# EAGLE design garden-bot (EAGLE 8.3.2)
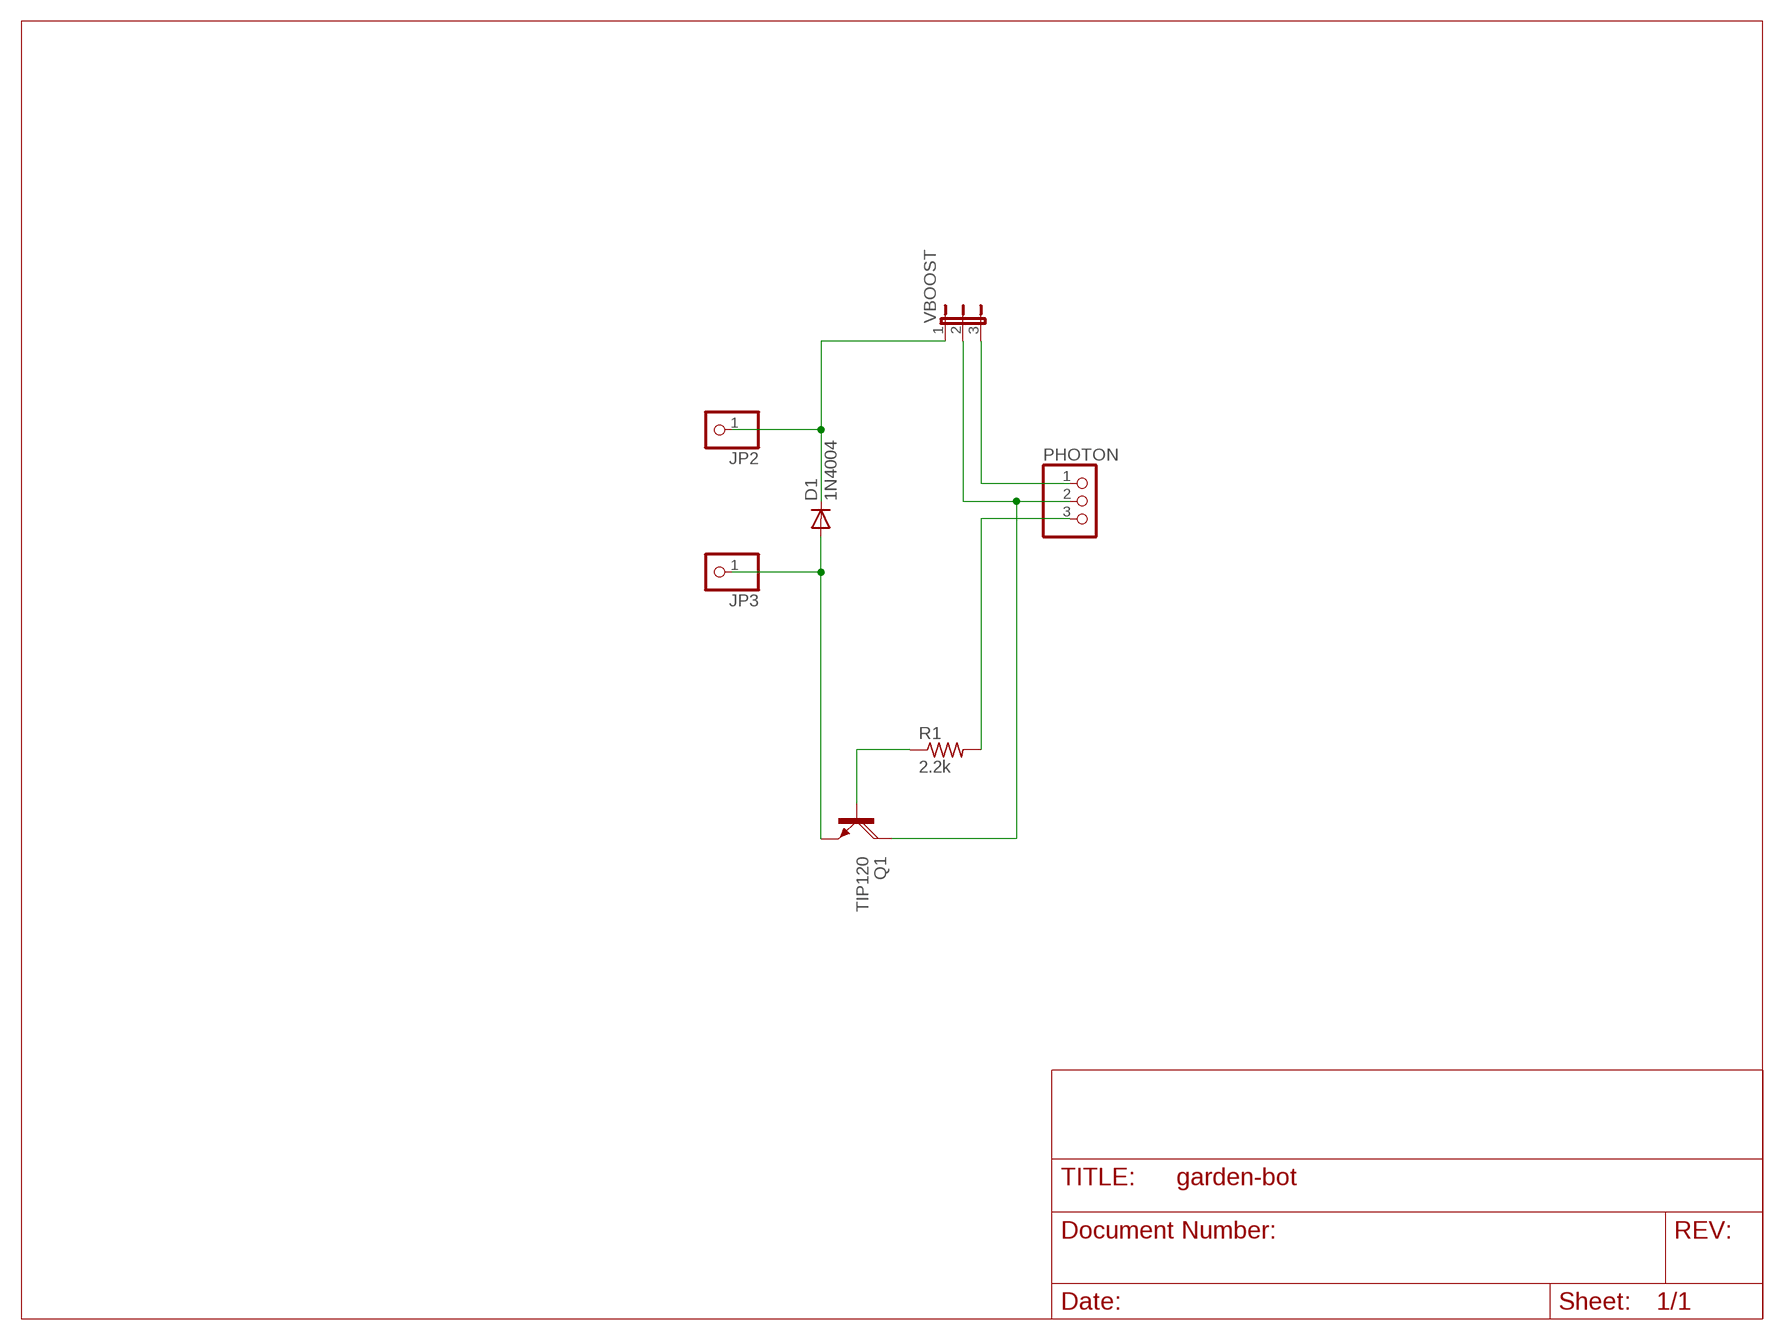
[diagram p0: schematic, sheet 1]

## Parts
D1  1N4004  [DO41-10]
JP2  PINHD-1X1  [1X01]
JP3  PINHD-1X1  [1X01]
PHOTON  PINHD-1X3  [1X03]
Q1  TIP120  [TO220AH]
R1  2.2k  R-US_0207/10  [0207/10]
VBOOST  JP2E  [JP2]

## Nets
D0: PHOTON.3 R1.2
GND: PHOTON.2 Q1.C VBOOST.2
N$2: Q1.B R1.1
N$5: D1.A JP3.1 Q1.E
VCC: PHOTON.1 VBOOST.3
VOUT: D1.C JP2.1 VBOOST.1

## Library data of the parts
D1 = adafruit:1N4004: DIODE General purpose 1N400x type rectifier (With bigger pads) http://www.ladyada.net/library/pcb/eaglelibrary.html
JP2 JP3 = adafruit:PINHD-1X1: Pin header 1x1 for 0.1" spacing With round pins
PHOTON = adafruit:PINHD-1X3: PIN HEADER
Q1 = transistor-power:TIP120: NPN DARLINGTON TRANSISTOR
R1 = adafruit:R-US_: RESISTOR, American symbol
VBOOST = jumper:JP2E: JUMPER

## Board
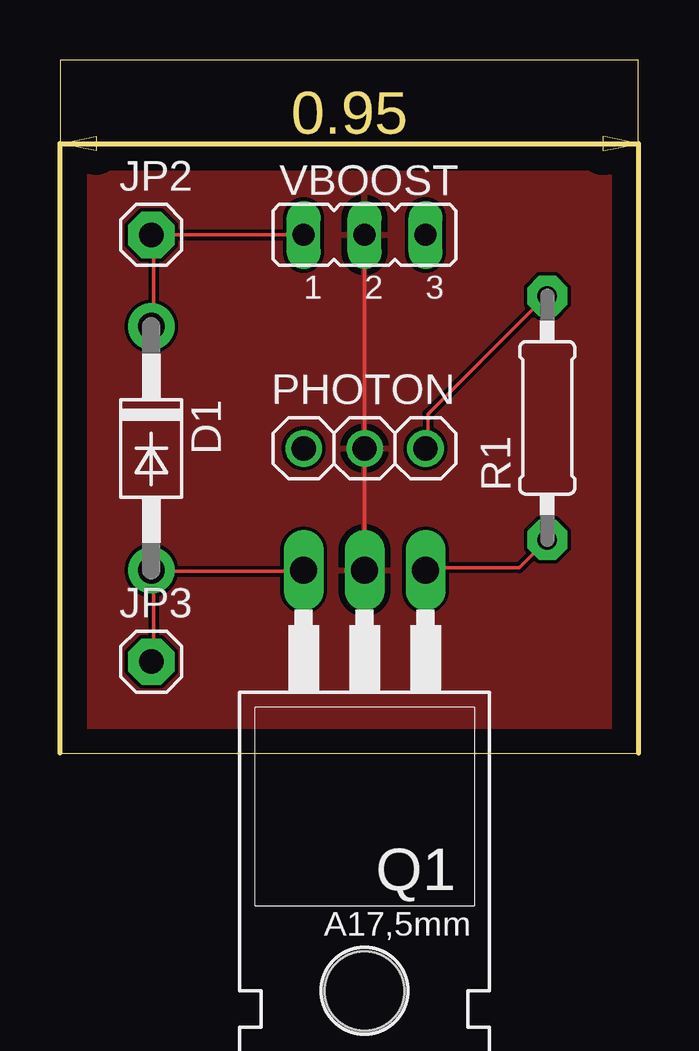
[diagram p1: board, top side]
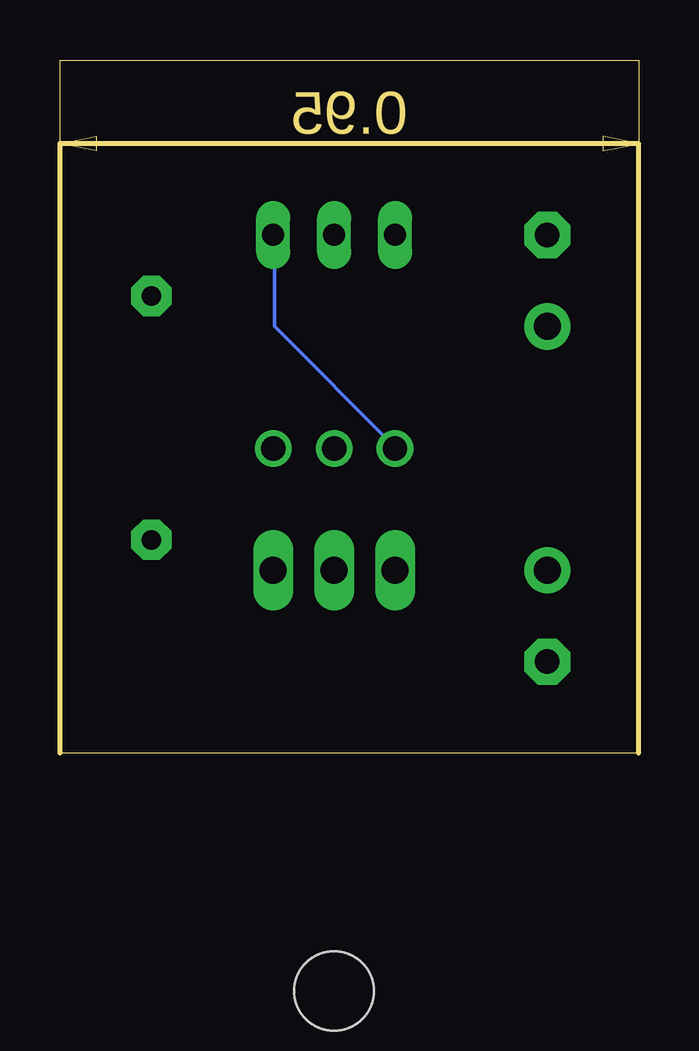
[diagram p2: board, bottom side, seen from below]

Size 24.13 x 28.88 mm. Coordinates in mm from the lower left corner, seen from the top.
Outline: 0,0 24.11,0 24.11,28.88 0,28.88 0,0
Copper layers (1*16): Top 0.035mm / dielectric 1.5mm / Bottom 0.035mm
Design rules "default": minimum track width 6mil, minimum drill 0.35mm, track to track 6mil, track to pad 6mil, pad to pad 6mil, via to via 6mil, smd to smd 6mil, copper to edge 40mil, drill to drill 6mil, minimum pad ring 10mil, minimum via ring 8mil, stop-mask expansion 4mil, vias tented up to drill 0mil, thermal gap 10mil

### Footprints (pad centres in the part's own frame; a part is rotated, then mirrored left to right if it is on the bottom)
DO41-10 = drill 1.118 pad 1.93: A 5.08,0; C -5.08,0
1X01 = drill 1.016 pad 1.93 octagon: 1 0,0
1X03 = drill 1.016: 1 -2.54,0; 2 0,0; 3 2.54,0
TO220AH = drill 1.118 long: B -2.54,-6.35; C 0,-6.35; E 2.54,-6.35 | hole 3.302: 0,11.176
0207/10 = drill 0.813 pad 1.676 octagon: 1 -5.08,0; 2 5.08,0
JP2 = drill 0.914 long: 1 -2.54,0; 2 0,0; 3 2.54,0

### Placement (x,y rotation side)
D1  3.81,12.7 270 top
JP2  3.81,21.59 0 top
JP3  3.81,3.81 0 top
PHOTON  12.7,12.7 0 top
Q1  12.7,1.27 180 top
R1  20.32,13.97 90 top
VBOOST  12.7,21.59 0 top

### Tracks (layer width: path | path; a pad name or v marks a point on that pad's centre or on a via)
D0
  Top 0.152: PHOTON.3 15.34,12.75 15.34,14.12 20.22,19 R1.2
GND
  Top 0.152: 12.75,21.59 VBOOST.2 PHOTON.2 | PHOTON.2 12.75,12.75 | 12.75,7.72 Q1.C PHOTON.2 | 12.75,12.6 PHOTON.2
  pour Top: 0,25.4 0,0 24.13,0 24.13,25.4
N$2
  Top 0.152: R1.1 19.15,7.72 15.34,7.72 Q1.B
N$5
  Top 0.152: 3.91,7.57 10.16,7.57 Q1.E | 3.91,7.57 3.91,3.91 JP3.1 | 3.91,7.57 D1.A
VCC
  Bottom 0.152: VBOOST.3 15.19,21.59 15.19,17.78 10.16,12.75 PHOTON.1
VOUT
  Top 0.152: 3.91,21.59 VBOOST.1 | 3.91,21.59 3.91,17.78 D1.C | 3.91,21.59 JP2.1